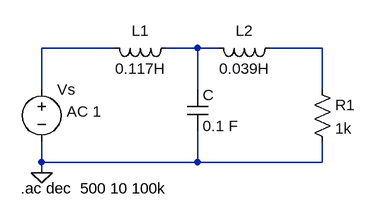
[diagram p0: schematic But.asc]
But.asc, the LTspice schematic file:
Version 4
SHEET 1 880 680
WIRE 112 48 0 48
WIRE 240 48 192 48
WIRE 272 48 240 48
WIRE 432 48 352 48
WIRE 0 112 0 48
WIRE 240 112 240 48
WIRE 432 112 432 48
WIRE 0 224 0 192
WIRE 240 224 240 176
WIRE 240 224 0 224
WIRE 432 224 432 192
WIRE 432 224 240 224
WIRE 0 240 0 224
FLAG 0 240 0
SYMBOL voltage 0 96 R0
WINDOW 123 39 50 Left 2
WINDOW 39 0 0 Left 2
SYMATTR Value2 AC 1
SYMATTR InstName Vs
SYMATTR Value ""
SYMBOL ind 208 32 R90
WINDOW 0 5 56 VBottom 2
WINDOW 3 32 56 VTop 2
SYMATTR InstName L1
SYMATTR Value 0.117H
SYMBOL ind 368 32 R90
WINDOW 0 5 56 VBottom 2
WINDOW 3 32 56 VTop 2
SYMATTR InstName L2
SYMATTR Value 0.039H
SYMBOL res 416 96 R0
SYMATTR InstName R1
SYMATTR Value 1k
SYMBOL cap 224 112 R0
SYMATTR InstName C
SYMATTR Value 0.1 F
TEXT -32 264 Left 2 !.ac dec  500 10 100k

The netlist it stands for:
* But.asc
Vs N001 0 AC 1
L1 N002 N001 0.117H
L2 N003 N002 0.039H
R1 N003 0 1k
C N002 0 0.1 F
.ac dec  500 10 100k
.backanno
.end